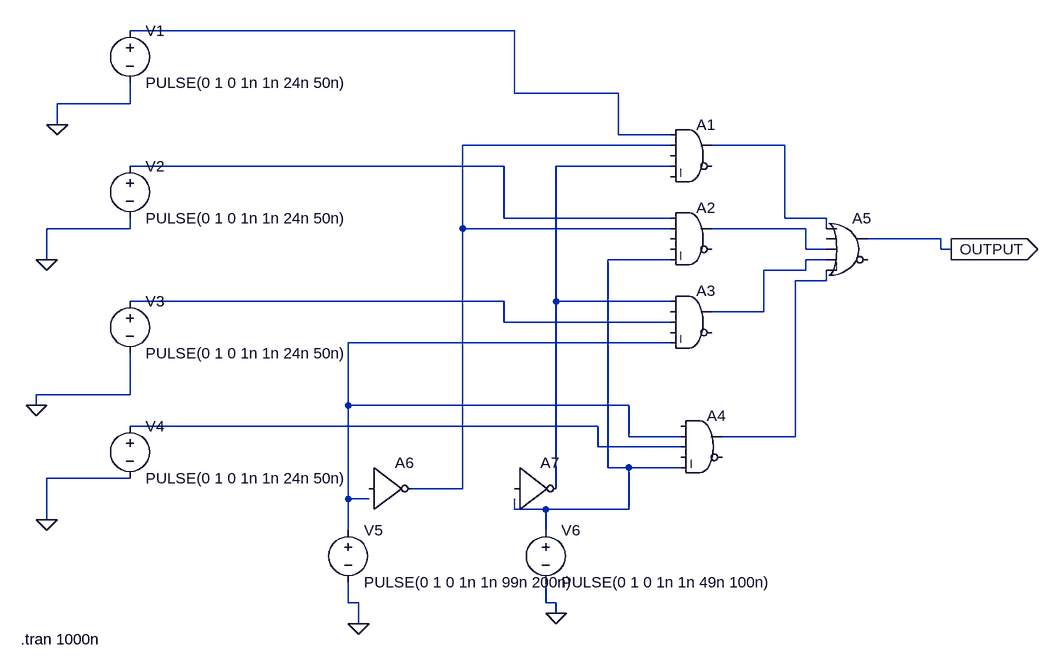
[diagram p0: schematic encoder4_2.asc]
encoder4_2.asc, the LTspice schematic file:
Version 4
SHEET 1 880 824
WIRE -16 -128 -608 -128
WIRE -16 -32 -16 -128
WIRE 144 -32 -16 -32
WIRE -608 -16 -608 -48
WIRE -608 -16 -720 -16
WIRE -720 16 -720 -16
WIRE 144 32 144 -32
WIRE 224 32 144 32
WIRE 224 48 -96 48
WIRE 400 48 288 48
WIRE -32 80 -608 80
WIRE 224 80 48 80
WIRE -32 160 -32 80
WIRE 224 160 -32 160
WIRE 400 160 400 48
WIRE 464 160 400 160
WIRE -608 176 -608 160
WIRE -608 176 -736 176
WIRE -96 176 -96 48
WIRE 224 176 -96 176
WIRE 432 176 288 176
WIRE 464 176 464 160
WIRE 640 192 528 192
WIRE 432 208 432 176
WIRE 464 208 432 208
WIRE 640 208 640 192
WIRE 656 208 640 208
WIRE -736 224 -736 176
WIRE 224 224 128 224
WIRE 464 224 432 224
WIRE 432 240 432 224
WIRE 432 240 368 240
WIRE 464 256 464 240
WIRE 464 256 416 256
WIRE -32 288 -608 288
WIRE 48 288 48 80
WIRE 224 288 48 288
WIRE 368 304 368 240
WIRE 368 304 288 304
WIRE -32 320 -32 288
WIRE 224 320 -32 320
WIRE 224 352 -272 352
WIRE -608 432 -608 368
WIRE -608 432 -752 432
WIRE -752 448 -752 432
WIRE -272 448 -272 352
WIRE 160 448 -272 448
WIRE 112 480 -608 480
WIRE 160 496 160 448
WIRE 240 496 160 496
WIRE 416 496 416 256
WIRE 416 496 304 496
WIRE 112 512 112 480
WIRE 240 512 112 512
WIRE 128 544 128 224
WIRE 160 544 128 544
WIRE 240 544 160 544
WIRE -608 560 -736 560
WIRE -96 576 -96 176
WIRE -96 576 -176 576
WIRE 48 576 48 288
WIRE -272 592 -272 448
WIRE -240 592 -272 592
WIRE -16 608 -16 592
WIRE 32 608 -16 608
WIRE 160 608 160 544
WIRE 160 608 32 608
WIRE -736 624 -736 560
WIRE -272 640 -272 592
WIRE 32 640 32 608
WIRE -272 752 -272 720
WIRE -256 752 -272 752
WIRE 32 752 32 720
WIRE 48 752 32 752
WIRE 48 768 48 752
WIRE -256 784 -256 752
FLAG 656 208 OUTPUT
IOPIN 656 208 Out
FLAG -256 784 0
FLAG 48 768 0
FLAG -736 624 0
FLAG -752 448 0
FLAG -736 224 0
FLAG -720 16 0
SYMBOL Digital\\and 256 0 R0
SYMATTR InstName A1
SYMBOL Digital\\and 256 128 R0
SYMATTR InstName A2
SYMBOL Digital\\and 256 256 R0
SYMATTR InstName A3
SYMBOL Digital\\and 272 448 R0
SYMATTR InstName A4
SYMBOL Digital\\or 496 144 R0
SYMATTR InstName A5
SYMBOL voltage -608 -144 R0
WINDOW 123 0 0 Left 0
WINDOW 39 0 0 Left 0
SYMATTR InstName V1
SYMATTR Value PULSE(0 1 0 1n 1n 24n 50n)
SYMBOL voltage -608 64 R0
WINDOW 123 0 0 Left 0
WINDOW 39 0 0 Left 0
SYMATTR InstName V2
SYMATTR Value PULSE(0 1 0 1n 1n 24n 50n)
SYMBOL voltage -608 272 R0
WINDOW 123 0 0 Left 0
WINDOW 39 0 0 Left 0
SYMATTR InstName V3
SYMATTR Value PULSE(0 1 0 1n 1n 24n 50n)
SYMBOL voltage -608 464 R0
WINDOW 123 0 0 Left 0
WINDOW 39 0 0 Left 0
SYMATTR InstName V4
SYMATTR Value PULSE(0 1 0 1n 1n 24n 50n)
SYMBOL voltage -272 624 R0
WINDOW 123 0 0 Left 0
WINDOW 39 0 0 Left 0
SYMATTR InstName V5
SYMATTR Value PULSE(0 1 0 1n 1n 99n 200n)
SYMBOL voltage 32 624 R0
WINDOW 123 0 0 Left 0
WINDOW 39 0 0 Left 0
SYMATTR InstName V6
SYMATTR Value PULSE(0 1 0 1n 1n 49n 100n)
SYMBOL Digital\\inv -240 512 R0
SYMATTR InstName A6
SYMBOL Digital\\inv -16 512 R0
SYMATTR InstName A7
TEXT -776 808 Left 2 !.tran 1000n

The netlist it stands for:
* encoder4_2.asc
A1 N001 N002 0 N005 0 0 N003 0 AND
A2 N004 N002 0 0 N007 0 N006 0 AND
A3 N005 0 N010 0 N011 0 N008 0 AND
A4 0 N011 N012 0 N007 0 N009 0 AND
A5 N003 0 N006 N008 N009 0 OUTPUT 0 OR
V1 N001 0 PULSE(0 1 0 1n 1n 24n 50n)
V2 N004 0 PULSE(0 1 0 1n 1n 24n 50n)
V3 N010 0 PULSE(0 1 0 1n 1n 24n 50n)
V4 N012 0 PULSE(0 1 0 1n 1n 24n 50n)
V5 N011 0 PULSE(0 1 0 1n 1n 99n 200n)
V6 N007 0 PULSE(0 1 0 1n 1n 49n 100n)
A6 N011 N011 N011 N011 N011 N002 N011 N011 BUF
A7 N007 N007 N007 N007 N007 N005 N007 N007 BUF
.tran 1000n
.backanno
.end